# EAGLE design s0-interface (EAGLE 6.3)
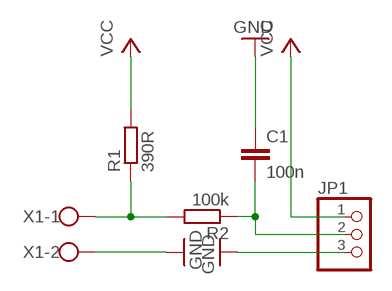
[diagram p0: schematic, sheet 1]

## Parts
C1  100n  C-EUC0603  [C0603]
JP1  PINHD-1X3  [1X03]
R1  390R  R-EU_R0603  [R0603]
R2  100k  R-EU_R0603  [R0603]
X1  W237-102  [W237-102]

## Nets
GND: C1.1 JP1.3 X1.2
N$1: R1.1 R2.2 X1.1
N$2: C1.2 JP1.2 R2.1
VCC: JP1.1 R1.2

## Library data of the parts
C1 = rcl:C-EU: CAPACITOR, European symbol
JP1 = pinhead:PINHD-1X3: PIN HEADER
R1 R2 = rcl:R-EU_: RESISTOR, European symbol
X1 = con-wago-500:W237-102: WAGO SCREW CLAMP; MPN: 237-102; OC_FARNELL: unknown; OC_NEWARK: 70K9898

## Board
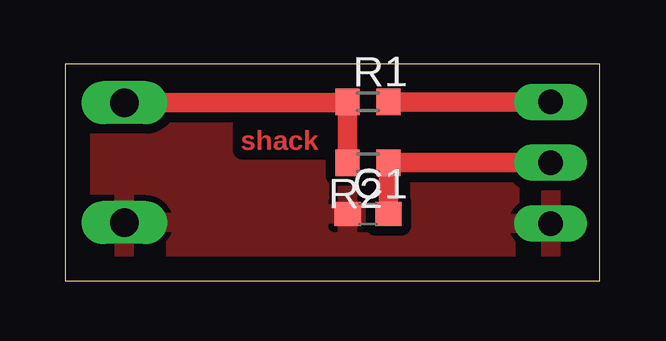
[diagram p1: board, top side]
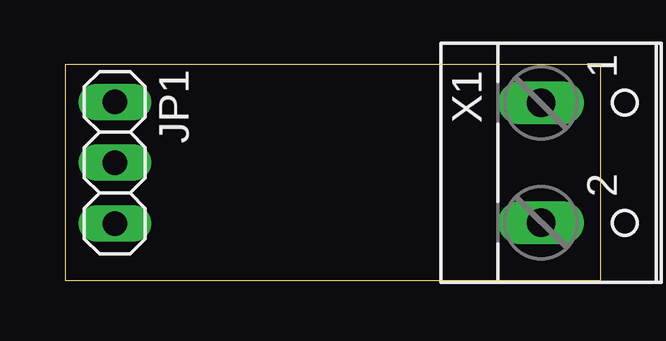
[diagram p2: board, bottom side, seen from below]

Size 22.29 x 9.04 mm. Coordinates in mm from the lower left corner, seen from the top.
Outline: 0,0 22.29,0 22.29,9.04 0,9.04 0,0
Copper layers (1*16): Top 0.035mm / dielectric 1.5mm / Bottom 0.035mm
Design rules "default": minimum track width 10mil, minimum drill 24mil, track to track 8mil, track to pad 8mil, pad to pad 8mil, via to via 8mil, smd to smd 8mil, copper to edge 40mil, drill to drill 8mil, minimum pad ring 10mil, minimum via ring 8mil, stop-mask expansion 4mil, vias tented up to drill 0mil, thermal gap 10mil

### Footprints (pad centres in the part's own frame; a part is rotated, then mirrored left to right if it is on the bottom)
C0603 = smd 1.1 x 1: 1 -0.85,0; 2 0.85,0
1X03 = drill 1.016 long: 1 -2.54,0; 2 0,0; 3 2.54,0
R0603 = smd 1 x 1.1: 1 -0.85,0; 2 0.85,0
W237-102 = drill 1.194 long: 1 -2.5,-1.27; 2 2.5,-1.27

### Placement (x,y rotation side)
C1  12.62,2.78 0 top
JP1  20.24,4.92 270 bottom
R1  12.62,7.46 0 top
R2  12.62,4.92 180 top
X1  1.19,4.92 270 bottom

### Tracks (layer width: path | path; a pad name or v marks a point on that pad's centre or on a via)
GND
  pour Top (isolate 0.406): -3.17,11.27 24.69,11.27 24.69,-4.92 -4.37,-4.92 -4.37,11.35
N$1
  Top 0.813: X1.1 11.77,7.42 R1.1 R2.2
N$2
  Top 0.813: JP1.2 R2.1 C1.2
VCC
  Top 0.813: JP1.1 R1.2

### Text on the board
Top: shack